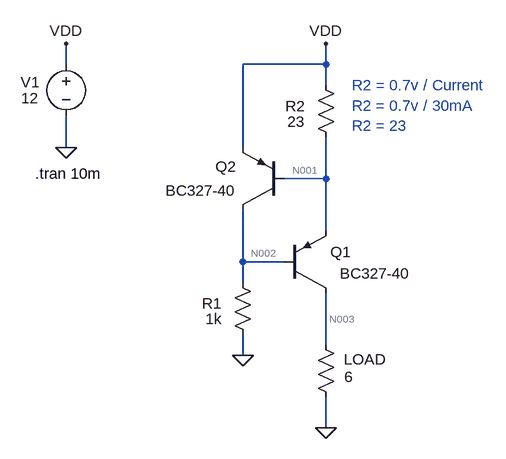
[diagram p0: schematic v1.0.asc]
v1.0.asc, the LTspice schematic file:
Version 4.1
SHEET 1 880 680
WIRE 64 -16 64 -48
WIRE 464 -16 464 -48
WIRE 464 -16 336 -16
WIRE 464 16 464 -16
WIRE 64 112 64 64
WIRE 336 112 336 -16
WIRE 464 160 464 96
WIRE 464 160 400 160
WIRE 464 240 464 160
WIRE 336 288 336 208
WIRE 400 288 336 288
WIRE 336 320 336 288
WIRE 464 416 464 336
WIRE 336 432 336 400
WIRE 464 544 464 496
FLAG 64 112 0
FLAG 464 544 0
FLAG 336 432 0
FLAG 64 -48 VDD
FLAG 464 -48 VDD
SYMBOL voltage 64 -32 R0
WINDOW 0 -70 43 Left 2
WINDOW 3 -69 68 Left 2
WINDOW 123 0 0 Left 0
WINDOW 39 0 0 Left 0
SYMATTR InstName V1
SYMATTR Value 12
SYMBOL res 352 416 R180
WINDOW 0 48 64 Left 2
WINDOW 3 48 40 Left 2
SYMATTR InstName R1
SYMATTR Value 1k
SYMBOL res 480 112 R180
WINDOW 0 48 64 Left 2
WINDOW 3 48 40 Left 2
SYMATTR InstName R2
SYMATTR Value 23
SYMBOL res 480 512 R180
WINDOW 0 -77 74 Left 2
WINDOW 3 -26 47 Left 2
SYMATTR InstName LOAD
SYMATTR Value 6
SYMBOL pnp 400 336 M180
WINDOW 0 103 63 Right 2
WINDOW 3 194 30 Right 2
SYMATTR InstName Q1
SYMATTR Value BC327-40
SYMBOL pnp 400 208 R180
WINDOW 0 106 67 Right 2
WINDOW 3 183 30 Right 2
SYMATTR InstName Q2
SYMATTR Value BC327-40
TEXT 16 152 Left 2 !.tran 10m
TEXT 504 16 Left 2 ;R2 = 0.7v / Current\nR2 = 0.7v / 30mA\nR2 = 23

The netlist it stands for:
* v1.0.asc
V1 VDD 0 12
R1 0 N002 1k
R2 N001 VDD 23
R§LOAD 0 N003 6
Q1 N003 N002 N001 0 BC327-40
Q2 N002 N001 VDD 0 BC327-40
.model NPN NPN
.model PNP PNP
.lib standard.bjt
.tran 10m
* R2 = 0.7v / Current
* R2 = 0.7v / 30mA
* R2 = 23
.backanno
.end

* Results of the author's LTspice run, read from the files saved beside the schematic
* Operating Point, zero values left out:
*   V(n001) = 11.36 V
*   V(n002) = 10.69 V
*   V(n003) = 168.1 mV
*   V(vdd) = 12 V
*   I(LOAD) = -28.01 mA
*   I(R1) = -10.69 mA
*   I(R2) = -28.04 mA
*   I(V1) = -38.7 mA
*   Ib(Q1) = -55.77 µA
*   Ib(Q2) = -28.26 µA
*   Ic(Q1) = -28.01 mA
*   Ic(Q2) = -10.63 mA
*   Ie(Q1) = 28.07 mA
*   Ie(Q2) = 10.66 mA
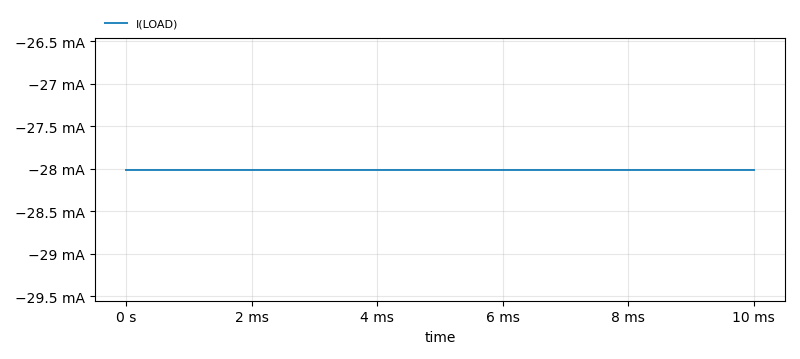
[diagram p1: Transient Analysis of v1.0.asc, plotted from the saved traces]
* Transient Analysis, 1 run:
*   I(LOAD): min -28.01 mA, max -28.01 mA, average -28.01 mA, rms 28.01 mA, last -28.01 mA